# EAGLE design ArduBerry 5_0 (EAGLE 6.4)
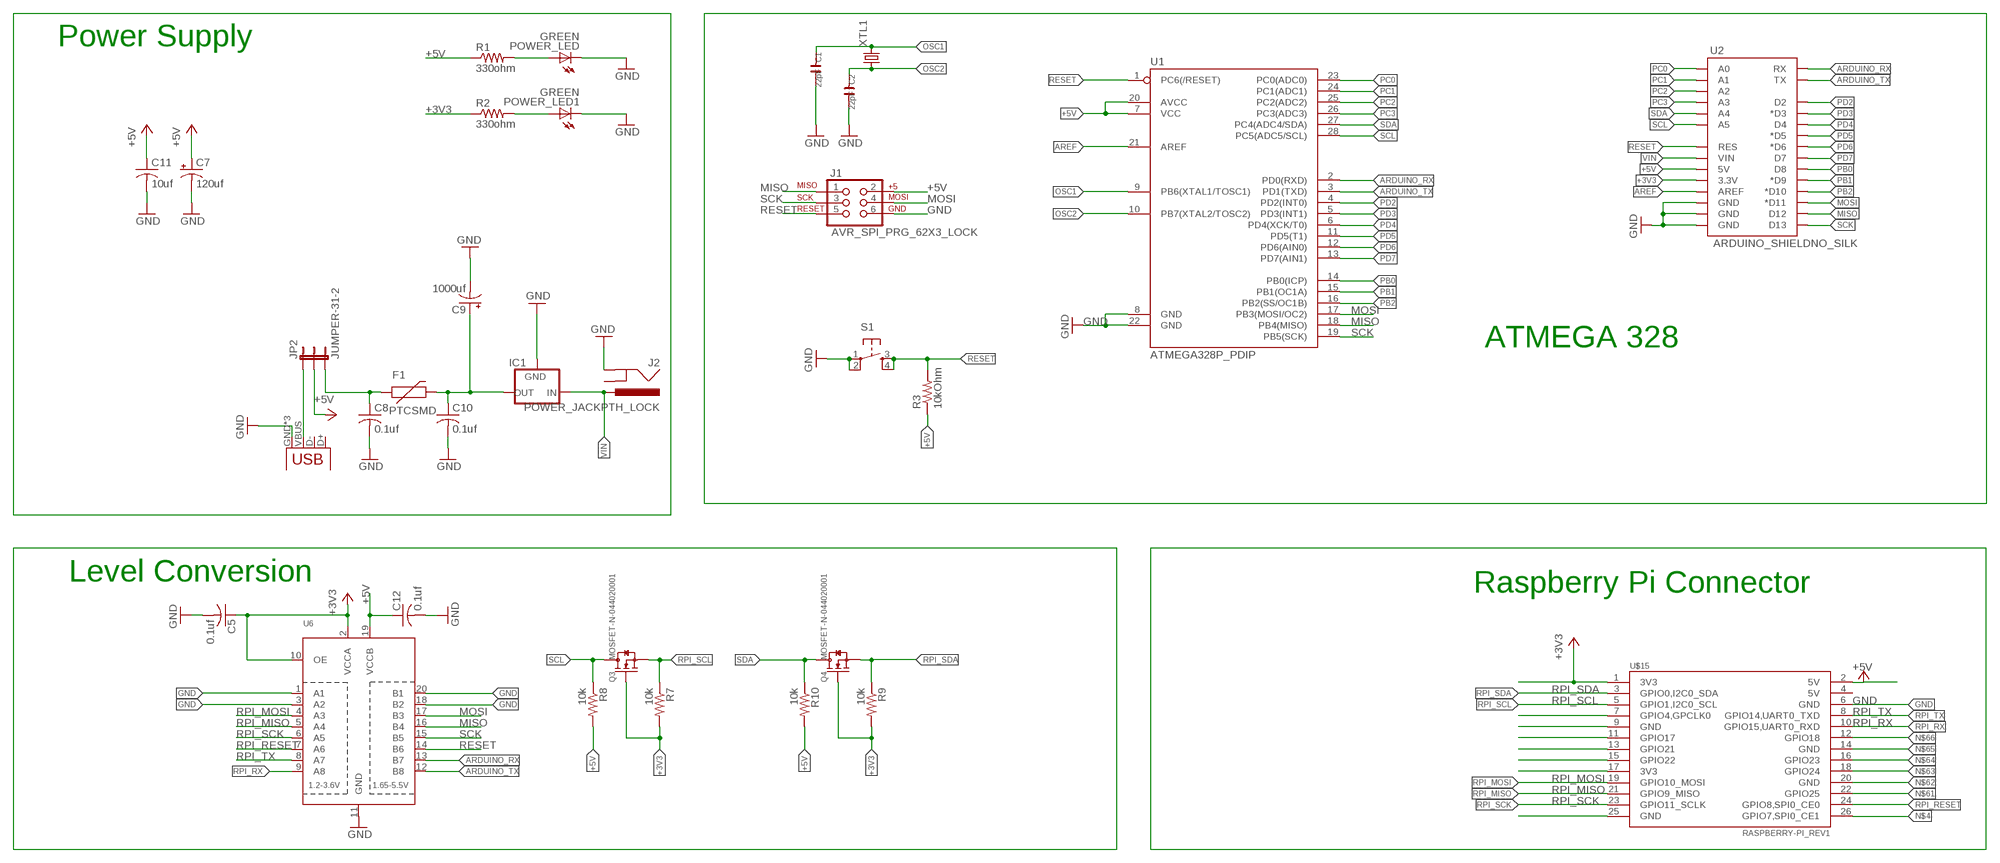
[diagram p0: schematic, sheet 1]

## Parts
C1  22pF  C-0805  [C0805]
C2  22pF  C-0805  [C0805]
C5  0.1uf  C-USC0603  [C0603]
C7  120uf  CPOL-USE2.5-6  [E2,5-6]
C8  0.1uf  C-USC0603  [C0603]
C9  1000uf  CPOL-USE3.5-10  [E3,5-10]
C10  0.1uf  C-USC0603  [C0603]
C11  10uf  C-USC0805  [C0805]
C12  0.1uf  C-USC0603  [C0603]
F1  PTCSMD  [PTC-1206]
IC1  V_REG_78XXSIDE  [78XXL]
J1  AVR_SPI_PRG_62X3_LOCK  [2X3_LOCK]
J2  POWER_JACKPTH_LOCK  [POWER_JACK_PTH_LOCK]
JP1  USB-MICROB  [USB-MICROB]
JP2  JUMPER-31-2  [SJ_3_PASTE1&2]
POWER_LED  GREEN  LED-GREEN0603  [LED-0603]
POWER_LED1  GREEN  LED-GREEN0603  [LED-0603]
Q3  MOSFET-N-044020001  [SOT23]
Q4  MOSFET-N-044020001  [SOT23]
R1  330ohm  RESISTOR0603  [0603-RES]
R2  330ohm  RESISTOR0603  [0603-RES]
R3  10kOhm  RESISTOR0603  [0603-RES]
R7  10k  RESISTOR0603  [0603-RES]
R8  10k  RESISTOR0603  [0603-RES]
R9  10k  RESISTOR0603  [0603-RES]
R10  10k  RESISTOR0603  [0603-RES]
S1  TAC_SWITCHPTH  [TACTILE-PTH]
U1  ATMEGA328P_PDIP  [DIL28-3]
U2  ARDUINO_SHIELDNO_SILK  [DUEMILANOVE_VIAS]
U6  TXB0108PWR  [TSSOP20]
U$15  RASPBERRY-PI_REV1  [RASPBERRY-PI_REV1]
XTL1  CRYSTALHC49S  [HC49/S]

## Nets
5V_IN_USB: JP1.VBUS JP2.1
+3V3 [POWER]: C5.1 Q3.1(G) Q4.1(G) R2.1 R7.2 R9.2 U2.3.3V U6.2(VCCA) U6.10(OE) U$15.1(3V3)
+5V [POWER]: C7.+ C11.1 C12.1 J1.2 JP2.2 R1.1 R3.1 R8.2 R10.2 U1.7(VCC) U1.20(AVCC) U2.5V U6.19(VCCB) U$15.2(5V)
ARDUINO_RX: U1.2(PD0(RXD)) U2.RX U6.13(B7)
ARDUINO_TX: U1.3(PD1(TXD)) U2.TX U6.12(B8)
AREF [DATA]: U1.21(AREF) U2.AREF
GND: C1.2 C2.2 C5.2 C7.- C8.2 C9.- C10.2 C11.2 C12.2 IC1.GND J1.6 J2.GND JP1.GND JP1.MT1(GND) JP1.MT2(GND) POWER_LED1.C POWER_LED.C S1.1 S1.2 U1.8(GND) U1.22(GND) U2.GND@0(GND) U2.GND@1(GND) U2.GND@2(GND) U6.1(A1) U6.3(A2) U6.11(GND) U6.18(B2) U6.20(B1) U$15.6(GND)
MISO: J1.1 U1.18(PB4(MISO)) U2.D12 U6.16(B4)
MOSI: J1.4 U1.17(PB3(MOSI/OC2)) U2.D11(*D11) U6.17(B3)
N$1: POWER_LED1.A R2.2
N$4: U$15.26(GPIO7,SPI0_CE1)
N$11: POWER_LED.A R1.2
N$48: U$15.7(GPIO4,GPCLK0)
N$49: U$15.9(GND)
N$50: U$15.11(GPIO17)
N$51: U$15.13(GPIO21)
N$52: U$15.15(GPIO22)
N$53: U$15.17(3V3)
N$54: U$15.25(GND)
N$61: U$15.22(GPIO25)
N$62: U$15.20(GND)
N$63: U$15.18(GPIO24)
N$64: U$15.16(GPIO23)
N$65: U$15.14(GND)
N$66: U$15.12(GPIO18)
OSC1: C1.1 U1.9(PB6(XTAL1/TOSC1)) XTL1.2
OSC2: C2.1 U1.10(PB7(XTAL2/TOSC2)) XTL1.1
PB0: U1.14(PB0(ICP)) U2.D8
PB1: U1.15(PB1(OC1A)) U2.D9(*D9)
PB2: U1.16(PB2(SS/OC1B)) U2.D10(*D10)
PC0: U1.23(PC0(ADC0)) U2.A0
PC1: U1.24(PC1(ADC1)) U2.A1
PC2: U1.25(PC2(ADC2)) U2.A2
PC3: U1.26(PC3(ADC3)) U2.A3
PD2: U1.4(PD2(INT0)) U2.D2
PD3: U1.5(PD3(INT1)) U2.D3(*D3)
PD4: U1.6(PD4(XCK/T0)) U2.D4
PD5: U1.11(PD5(T1)) U2.D5(*D5)
PD6: U1.12(PD6(AIN0)) U2.D6(*D6)
PD7: U1.13(PD7(AIN1)) U2.D7
REG_OUT [POWER]: C8.1 F1.1 JP2.3
RESET: J1.5 R3.2 S1.3 S1.4 U1.1(PC6(/RESET)) U2.RES U6.14(B6)
RPI_MISO: U6.5(A4) U$15.21(GPIO9_MISO)
RPI_MOSI: U6.4(A3) U$15.19(GPIO10_MOSI)
RPI_RESET: U6.7(A6) U$15.24(GPIO8,SPI0_CE0)
RPI_RX: U6.9(A8) U$15.10(GPIO15,UART0_RXD)
RPI_SCK: U6.6(A5) U$15.23(GPIO11_SCLK)
RPI_SCL: Q3.2(S) R7.1 U$15.5(GPIO1,I2C0_SCL)
RPI_SDA: Q4.2(S) R9.1 U$15.3(GPIO0,I2C0_SDA)
RPI_TX: U6.8(A7) U$15.8(GPIO14,UART0_TXD)
SCK: J1.3 U1.19(PB5(SCK)) U2.D13 U6.15(B5)
SCL: Q3.3(D) R8.1 U1.28(PC5(ADC5/SCL)) U2.A5
SDA: Q4.3(D) R10.1 U1.27(PC4(ADC4/SDA)) U2.A4
VIN: IC1.IN J2.PWR U2.VIN
VIN_5V: C9.+ C10.1 F1.2 IC1.OUT
Unconnected: J2.GNDBREAK JP1.D+ JP1.D- U$15.4(5V)

## Notes on the sheet
- Power Supply
- ATMEGA 328
- Level Conversion
- Raspberry Pi Connector

## Library data of the parts
C1 C2 = OPL:C*
C5 C8 C10 C12 = resistor:C-US: CAPACITOR, American symbol
C7 C9 = rcl:CPOL-US: POLARIZED CAPACITOR, American symbol
C11 = rcl:C-US: CAPACITOR, American symbol
F1 = zz SparkFun:PTC: Resettable Fuse PTC Resettable Fuse. Spark Fun Electronics SKU : COM-08357
IC1 = SparkFun-PowerIC:V_REG_78XX: Voltage Regulator Standard 7805 5V regulator. IGO (Input Ground Output). Spark Fun Electronics SKU : COM-00107
J1 = SparkFun-Connectors:AVR_SPI_PRG_6: AVR ISP 6 Pin This is the reduced ISP connector for AVR programming. Common on Arduino. This footprint will take up less PCB space and can be used with a 10-pin to 6-pin adapter such as SKU: BOB-08508
J2 = SparkFun-Connectors:POWER_JACK: Power Jack This is the standard 5.5mm barrel jack for power. The PTH is the most common, proven, reliable, footprint. The Slot footprint only works if the mill layer is transmitted to the PCB fab house so be warned. Spark Fun Electronics SKU : PRT-00119 SMT: CONN-08106 Mating wall wart : TOL-00298 (and others)
JP1 = SparkFun-Connectors:USB: USB Connectors USB-B-PTH is fully proven SKU : PRT-00139/CONN-08278 USB-miniB is fully proven SKU : PRT-00587 USB-A-PCB is untested. USB-A-H is throughly reviewed, but untested. Spark Fun Electronics SKU : PRT-00437 USB-B-SMT is throughly reviewed, but untested. Needs silkscreen touching up. USB-A-S has not been used/tested USB-MB-H has not been used/tested USB-MICROB has been used. CONN-09505; PROD_ID: CONN-09505
JP2 = SparkFun-Passives:JUMPER-3
POWER_LED POWER_LED1 = SparkFun-LED:LED-GREEN: Various green LEDs 0603- DIO-00821 LARGE- DIO-00862 LILYPAD- DIO-09910; PROD_ID: DIO-00821
Q3 Q4 = OPL:MOSFET-N: CJ2302：SMD MOSFET N-CH 20V-2.1A
R1-R3 R7-R10 = SparkFun-Resistors:RESISTOR: Resistor Basic schematic elements and footprints for 0603, 1206, and PTH resistors.
S1 = SparkFun-Electromechanical:TAC_SWITCH: Momentary Switch Button commonly used for reset or general input. Spark Fun Electronics SKU : COM-00097 SMT- SWCH-08247
U1 = SparkFun-DigitalIC:ATMEGA328P_PDIP: uC used in the Arduino 32kb flash, 1k EEPROM, 2k SRAM This is the through-hole version of this chip.
U2 = SparkFun-Boards:ARDUINO_SHIELD: Arduino shield footprint
U6 = adafruit:TXB0108PWR: 8-Bit Bi-Directional Level Shifter 1.2V-3.6V (VCCA) to 1.65V-5.5V (VCCB) bi-directional level shifter with auto direction sensing. Max data rate - VCCA 1.8V: 20Mbps (50ns), VCCA 3.3V: 100Mbps (10ns) Digikey: 296-21527-1-ND
U$15 = RaspberryPi:RASPBERRY-PI_REV1: Raspberry Pi Board <http://www.raspberrypi.org/> Jacques Lagnel V1.0 (beta) 2012 Mateusz Bawaj V1.1 (beta) 2012 Board dimension: Forum 3D model <http://www.raspberrypi.org/forum/general-discussion/mechanical-profile-3d-models?value=3d%20model&type=1&include=1&search=1&ret=all> The GPIO Connector (P1): http://elinux.org/RPi_Low-level_peripherals
XTL1 = crystal:CRYSTAL: CRYSTAL; OC_FARNELL: 1667008; OC_NEWARK: unknown

## Net classes
1 DATA: width 0.203 mm, drill 0.305 mm, clearance 0.051 mm
2 POWER: width 0.152 mm, drill 0.356 mm, clearance 0.051 mm

## Board
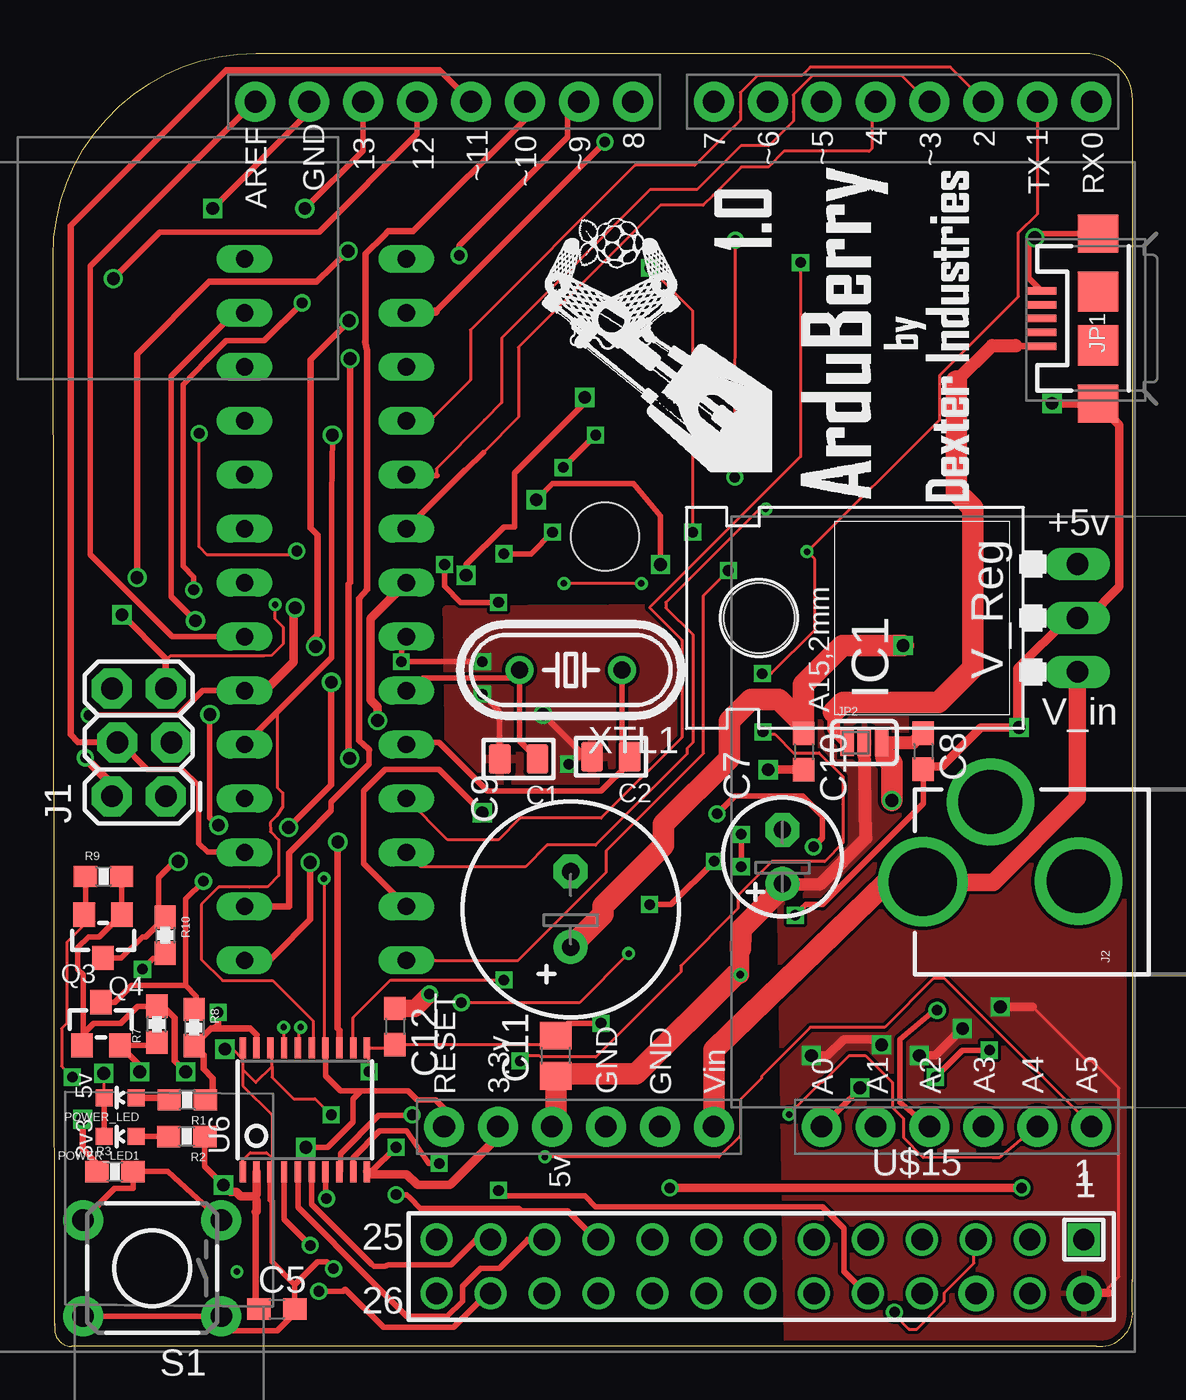
[diagram p1: board, top side]
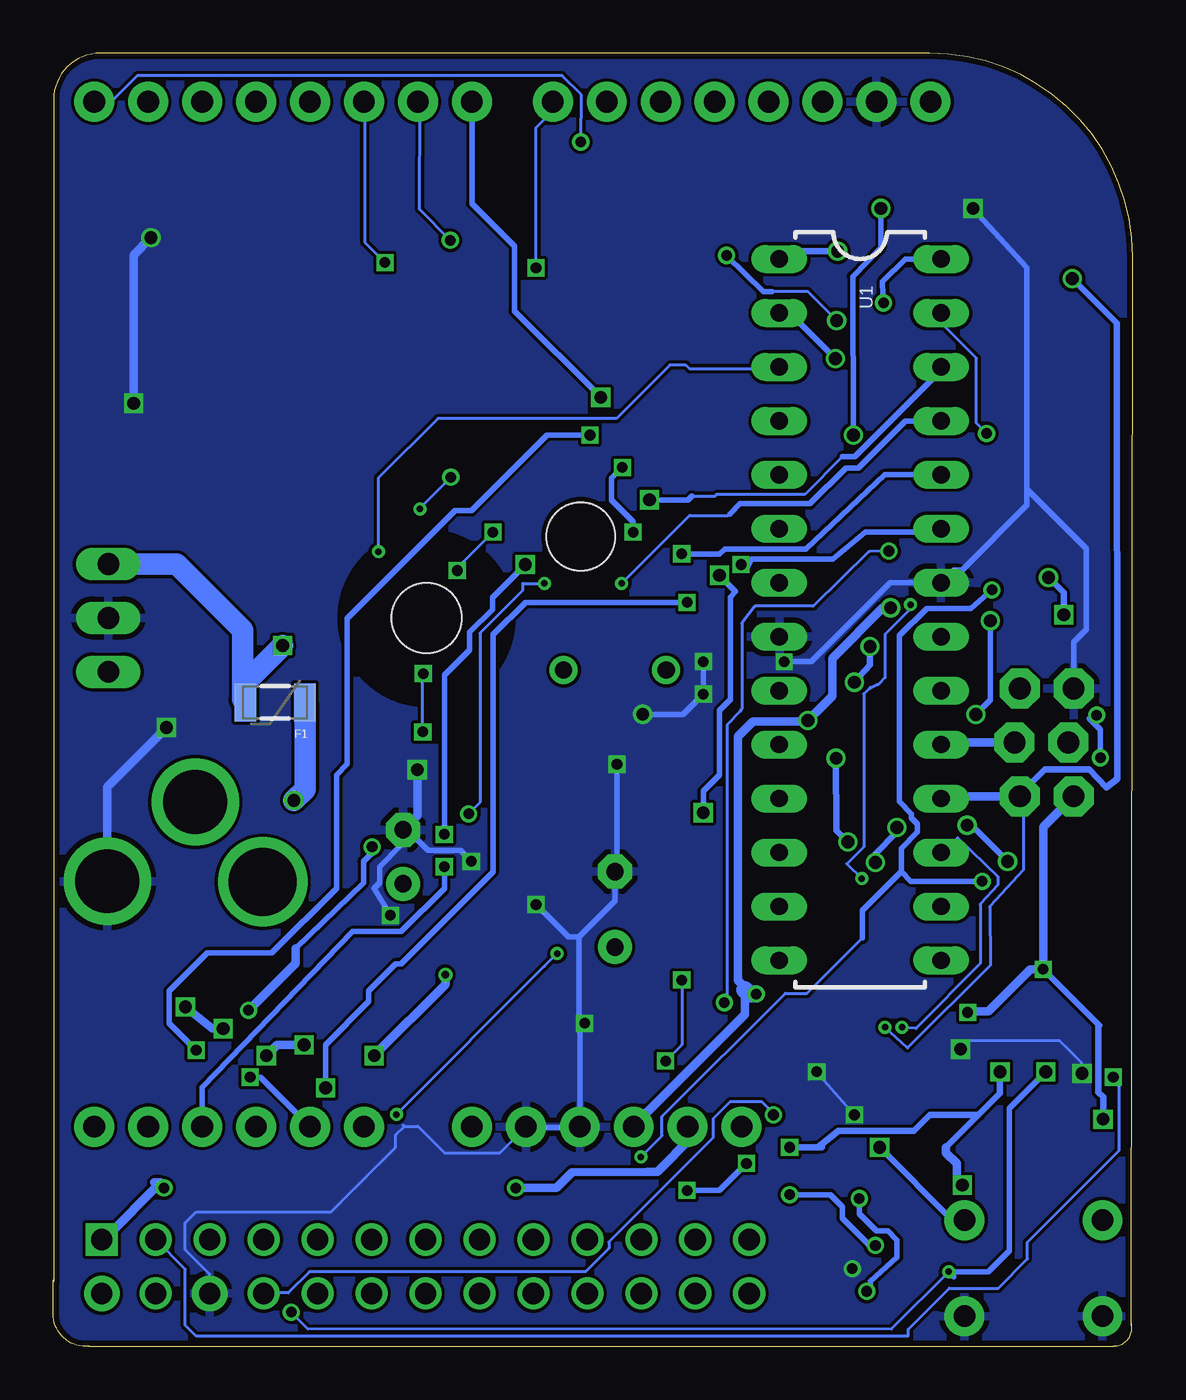
[diagram p2: board, bottom side, seen from below]

Size 50.82 x 60.89 mm. Coordinates in mm from the lower left corner, seen from the top.
Outline: 0.07,0.97 0,51.31 arc-90 9.56,60.89 48.59,60.89 arc-90 50.8,58.68 50.8,3.05
Outline: 49.14,0 0.87,0
Outline: 49.11,0 49.42,0 arc90 50.82,1.68 50.82,3.13
Outline: 0.07,1.07 0.07,0.81 arc90 0.88,0
Copper layers (1*16): Top 0.035mm / dielectric 1.5mm / Bottom 0.035mm
Design rules "Fusion_eagle_rule_v1.1": minimum track width 6mil, minimum drill 12mil, track to track 6mil, track to pad 6mil, pad to pad 6mil, via to via 6mil, smd to smd 0mil, copper to edge 10mil, drill to drill 10mil, minimum pad ring 10mil, minimum via ring 6mil, stop-mask expansion 2mil, vias tented up to drill 100mil, thermal gap 10mil
Holes 3.2 mm at -29.52,11.63 25.98,38.13

### Footprints (pad centres in the part's own frame; a part is rotated, then mirrored left to right if it is on the bottom)
C0805 = smd 1.016 x 1.397: 1 -0.889,0; 2 0.889,0
C0603 = smd 1.1 x 1: 1 -0.85,0; 2 0.85,0
E2,5-6 = drill 0.813 pad 1.6: + -1.27,0 | drill 0.813 pad 1.6 octagon: - 1.27,0
E3,5-10 = drill 0.813 pad 1.6: + -1.778,0 | drill 0.813 pad 1.6 octagon: - 1.778,0
C0805' = smd 1.3 x 1.5: 1 -0.95,0; 2 0.95,0
PTC-1206 = smd 1 x 1.8: 1 -1.4,0; 2 1.4,0
78XXL = drill 1.016 long: GND 0,-3.81; IN -2.54,-3.81; OUT 2.54,-3.81 | hole 3.302: 0,11.176
2X3_LOCK = drill 1.016 pad 1.88 octagon: 1 0,0; 2 0,2.54; 3 2.54,-0.254; 4 2.54,2.286; 5 5.08,0; 6 5.08,2.54
POWER_JACK_PTH_LOCK = drill 2.997 pad 4.115: GND 0.025,6.557; GNDBREAK 3.762,10.7 | drill 3.2 pad 4.115: PWR 0,13.878
USB-MICROB = smd 0.35 x 1.4: D+ 0,2.65; D- -0.65,2.65; GND 1.3,2.65; ID 0.65,2.65; VBUS -1.3,2.65 | smd 1.8 x 1.9: MT1 -4,0; MT2 4,0 | smd 1.9 x 1.9: P$1 -1.27,0; P$2 1.27,0
SJ_3_PASTE1&2 = smd 0.635 x 1.27: 1 -0.813,0; 2 0,0; 3 0.813,0
LED-0603 = smd 0.8 x 0.8: A 0,-0.75; C 0,0.75
SOT23 = smd 1.016 x 1.143: 1 -0.889,-1.016; 2 0.889,-1.016; 3 0,1.016
0603-RES = smd 1.1 x 1: 1 -0.85,0; 2 0.85,0
TACTILE-PTH = drill 1.016 pad 1.88: 1 -3.251,2.261; 2 3.251,2.261; 3 -3.251,-2.261; 4 3.251,-2.261
DIL28-3 = drill 0.813 long: 1 -16.51,-3.81; 2 -13.97,-3.81; 3 -11.43,-3.81; 4 -8.89,-3.81; 5 -6.35,-3.81; 6 -3.81,-3.81; 7 -1.27,-3.81; 8 1.27,-3.81; 9 3.81,-3.81; 10 6.35,-3.81; 11 8.89,-3.81; 12 11.43,-3.81; 13 13.97,-3.81; 14 16.51,-3.81; 15 16.51,3.81; 16 13.97,3.81; 17 11.43,3.81; 18 8.89,3.81; 19 6.35,3.81; 20 3.81,3.81; 21 1.27,3.81; 22 -1.27,3.81; 23 -3.81,3.81; 24 -6.35,3.81; 25 -8.89,3.81; 26 -11.43,3.81; 27 -13.97,3.81; 28 -16.51,3.81
DUEMILANOVE_VIAS = drill 1.016 pad 1.88: 3.3V 50.8,13.97; 5V 50.8,16.51; A0 50.8,29.21; A1 50.8,31.75; A2 50.8,34.29; A3 50.8,36.83; A4 50.8,39.37; A5 50.8,41.91; AREF 2.54,2.54; D2 2.54,36.83; D3 2.54,34.29; D4 2.54,31.75; D5 2.54,29.21; D6 2.54,26.67; D7 2.54,24.13; D8 2.54,20.32; D9 2.54,17.78; D10 2.54,15.24; D11 2.54,12.7; D12 2.54,10.16; D13 2.54,7.62; GND@0 50.8,19.05; GND@1 50.8,21.59; GND@2 2.54,5.08; RES 50.8,11.43; RX 2.54,41.91; TX 2.54,39.37; VIN 50.8,24.13
TSSOP20 = smd 0.305 x 0.991: 1 -2.925,-2.918; 2 -2.275,-2.918; 3 -1.625,-2.918; 4 -0.975,-2.918; 5 -0.325,-2.918; 6 0.325,-2.918; 7 0.975,-2.918; 8 1.625,-2.918; 9 2.275,-2.918; 10 2.925,-2.918; 11 2.925,2.918; 12 2.275,2.918; 13 1.625,2.918; 14 0.975,2.918; 15 0.325,2.918; 16 -0.325,2.918; 17 -0.975,2.918; 18 -1.625,2.918; 19 -2.275,2.918; 20 -2.925,2.918
RASPBERRY-PI_REV1 = drill 1 square: 1 -41.91,21.59 | drill 1 pad 1.676: 2 -41.91,24.13; 6 -36.83,24.13 | drill 1: 3 -39.37,21.59; 4 -39.37,24.13; 5 -36.83,21.59; 7 -34.29,21.59; 8 -34.29,24.13; 9 -31.75,21.59; 10 -31.75,24.13; 11 -29.21,21.59; 12 -29.21,24.13; 13 -26.67,21.59; 14 -26.67,24.13; 15 -24.13,21.59; 16 -24.13,24.13; 17 -21.59,21.59; 18 -21.59,24.13; 19 -19.05,21.59; 20 -19.05,24.13; 21 -16.51,21.59; 22 -16.51,24.13; 23 -13.97,21.59; 24 -13.97,24.13; 25 -11.43,21.59; 26 -11.43,24.13
HC49/S = drill 0.813: 1 -2.413,0; 2 2.413,0

### Placement (x,y rotation side)
C1  21.92,27.66 180 top
C2  26.26,27.76 180 top
C5  10.53,1.75 0 top
C7  34.34,23.05 90 top
C8  40.96,28.02 270 top
C9  24.37,20.58 90 top
C10  35.34,28 270 top
C11  10uf  [C0805']  23.67,13.69 90 top
C12  16.09,15.06 270 top
F1  40.36,30.32 180 bottom
IC1  44.42,34.29 90 top
J1  5.31,25.89 90 top
J2  54.83,21.87 90 top
JP1  49.19,48.39 90 top
JP2  38.19,28.42 0 top
POWER_LED  3.16,11.71 90 top
POWER_LED1  3.17,9.88 90 top
Q3  2.25,15.19 0 top
Q4  2.35,19.31 180 top
R1  6.31,11.61 180 top
R2  6.29,9.88 180 top
R3  2.91,8.23 0 top
R7  4.89,15.17 90 top
R8  6.65,15.01 270 top
R9  2.38,22.12 0 top
R10  5.27,19.36 270 top
S1  4.66,3.68 180 top
U1  12.82,34.68 270 bottom
U2  6.98,61.14 270 top
U6  11.85,11.13 0 top
U$15  6.62,26.62 180 top
XTL1  24.37,31.84 180 top

### Tracks (layer width: path | path; a pad name or v marks a point on that pad's centre or on a via)
5V_IN_USB
  Top 0.305: 45.33,47.09 JP1.VBUS
  Top 0.61: 42.54,45.44 44.21,47.12 45.3,47.12 45.33,47.09 | 36.74,29.87 36.74,29.06 JP2.1
  Top 1.016: 42.54,45.44 42.54,40.24 43.3,39.47 43.3,31.93 41.67,30.3 37.18,30.3 36.74,29.87
+3V3  (via drill 0.5, 0.6)
  Top 0.254: R9.2 3.23,20.34 Q4.1 3.22,20.32 2.18,19.28 1.67,19.28 1.16,18.77 1.16,17.76 1.41,17.5 1.41,14.71 | 1.41,14.71 1.41,14.23 Q3.1 | R7.2 3.99,16.02 3.19,15.22 1.92,15.22 1.41,14.71 | R2.1 7.14,8.47 v8.02,7.6
  Top 0.305: R7.2 5.19,16.02 5.73,15.47 5.73,13.44 v6.24,12.93 | 9.54,6.33 9.54,1.9 C5.1 | 9.58,6.87 U6.2 9.58,8.14 9.54,8.1 | U6.10 14.98,8.21 v16.15,9.37
  Top 0.406: v45.6,7.46 v29.04,7.46 | U2.3.3V 20.95,9.86 18.69,7.6 17.16,7.6 16.65,8.1 14.88,8.1 U6.10 | 9.58,6.87 9.58,6.36 9.54,6.33 | U6.2 9.58,7.15 9.49,7.06 8.83,7.06 8.63,7.27 8.35,7.27 v8.02,7.6
  Bottom 0.305: v6.24,12.93 6.24,11.91 7.26,10.9 | 7.26,10.9 8.78,9.37 | 14.62,9.37 14.82,9.37 | 14.82,9.37 13.86,10.14 10.3,10.14 9.54,10.9 7.26,10.9 | v16.15,9.37 15.07,9.37 14.82,9.37
  Bottom 0.406: v29.04,7.46 28.72,7.47 27.12,7.47 26.38,8.21 22.85,8.22 22.38,8.22 20.72,9.88 20.72,10.11 U2.3.3V | v45.6,7.46 46.05,7.72 45.75,7.72 48.35,5.12 U$15.1 | 8.78,9.37 8.78,9.12 8.27,8.61 8.27,7.85 v8.02,7.6
+5V  (via drill 0.36, 0.5, 0.6)
  Top 0.152: U6.19 9.58,13.98 9.54,13.95 | 49.67,2.52 49.67,2.77 50.18,3.28 50.18,12.17 48.91,13.44 48.66,13.44 46.12,15.98
  Top 0.254: v1.69,29.72 5.88,29.72 7.04,30.87 U1.20 | 7.51,11.95 R1.1 | U6.19 9.58,14.67 | 7.45,14.96 R8.2 6.71,14.16 | R10.2 5.52,18.26 4.72,18.26 v4.21,17.76
  Top 0.305: 9.58,14.67 9.29,14.96 7.56,14.96 | 7.56,14.96 7.45,14.96 | 7.51,11.95 7.51,12.63 7.08,13.06 7.08,13.73 R8.2 | R3.1 2.06,8.62 1.39,9.3 v1.39,10.7 | v7.76,15.72 7.76,15.17 7.56,14.96
  Top 0.406: U2.5V 23.68,10.34 | U1.20 9.98,30.87 11.32,32.21 11.32,34.7 v11.4,34.77 | v15.28,29.47 15.28,30.1 14.95,30.43 14.95,34.27 U1.7 | 34.25,21.52 C7.+ | 23.85,12.82 C11.1 | 32.15,17.52 v32.35,17.5 | v35.7,13.69 36.47,13.69 37.23,14.45 38.75,14.45 v39.01,14.2 | v40.78,13.69 41.55,13.69 v42.82,14.96 | v44.59,15.98 46.12,15.98 | 49.67,2.52 48.56,2.52 U$15.2 | J1.2 2.77,26.46 v1.52,27.71
  Top 0.61: C7.+ 36.09,21.75 38.27,23.93 JP2.2
  Top 0.813: 32.35,18.72 v32.35,17.5 | C12.1 17.05,15.91 v17.72,16.59
  Top 1.016: 23.68,10.34 C11.1 | 32.35,18.72 32.38,19.41 32.4,19.65 34.25,21.52 | 23.85,12.82 27.45,12.82 32.15,17.52
  Bottom 0.254: v1.69,29.72 2.05,29.57 1.52,29.03 v1.52,27.71
  Bottom 0.305: v1.39,10.7 1.39,11.74 1.62,11.97 1.62,15.06 1.57,15.11 v4.21,17.76
  Bottom 0.406: v11.4,34.77 11.75,34.77 14.14,32.39 14.14,30.61 v15.28,29.47 15.45,29.42 17.88,29.42 18.58,28.72 18.58,17.22 18.25,16.89 18.25,16.79 18.25,15.62 23.45,10.42 U2.5V | v32.35,17.5 32.35,17.04 v35.7,13.69 | v39.01,14.2 40.28,14.2 v40.78,13.69 | v42.82,14.96 43.32,14.96 v44.59,15.98 | v7.76,15.72 7.71,15.78 6.8,15.78 4.82,17.76 v4.21,17.76 4.21,24.46 J1.2
  Bottom 0.813: v17.72,16.59 18.05,16.59 18.25,16.79
  pour Top: 33.77,49.51 34.53,0.23 50.64,0.13 50.74,49.61
ARDUINO_RX  (via drill 0.5, 0.6)
  Top 0.254: 18,48.72 v25.98,56.7
  Top 0.305: v13.99,46.51 13.99,35.97 13.91,35.89 13.91,30.23 13.91,27.66 v13.96,27.69 | v13.4,23.75 13.4,14.96 13.48,14.89 U6.13
  Top 0.406: 18,48.72 16.7,48.72 U1.2
  Bottom 0.152: v25.98,56.7 25.95,58.92 26.85,59.82 46.85,59.82 48.05,58.62 48.85,58.62 U2.RX
  Bottom 0.305: U1.2 16.13,48.65 v13.99,46.51 | v13.96,27.69 13.94,24.28 v13.4,23.75
ARDUINO_TX  (via drill 0.3, 0.5)
  Top 0.152: U2.TX 46.35,58.42 46.35,53.32 45.45,52.42 45.45,49.42 41.75,45.72 41.75,43.62 35.53,37.42 v35.5,37.42 35.86,37.07 35.86,33.73 33.8,31.68 v33.39,31.68 | U6.12 14.13,15.48 15.89,17.25 v21.23,17.25 | v21.99,13.44 22.24,13.69 22.88,13.69 22.95,13.62 25.55,13.62 29.55,17.62 29.55,17.92 32.25,20.62 32.25,21.22 33.85,22.82 36.33,22.82 37.18,23.69 37.18,25.53 37.18,26.82 36.06,27.94 34.87,27.94 34,28.81 33.54,28.81 v33.42,28.93
  Top 0.254: U2.TX 46.35,58.52
  Top 0.305: U1.3 17.63,46.11
  Bottom 0.152: U1.3 16.65,46.02 20.85,46.02 21.04,46.2 21.78,46.2 24.3,43.69 32.71,43.69 35.5,40.89 v35.5,37.42 | v21.23,17.25 21.23,14.2 v21.99,13.44 | v33.42,28.93 33.42,31.73 v33.39,31.68
AREF
  Top 0.254: U2.AREF 9.49,58.6 1.74,50.85 1.74,37.29 5.6,33.43 9,33.43 U1.21
GND  (via drill 0.48, 0.5, 0.6)
  Top 0.152: 34.25,24.22 C7.- | 46.12,52.25 46.15,52.22 v46.22,52.2 | 8.93,13.04 8.93,12.27 10.3,10.9 10.3,8.87 | 10.3,8.87 10.3,8.28 U6.3 | U6.20 8.93,13.51 | 8.93,13.51 8.93,13.04 | 8.93,13.04 9.54,12.42 10.3,13.18 | 10.3,13.18 10.3,13.97 U6.18 | 2.41,11.68 POWER_LED.C 2.41,12.82 v2.38,12.85 | U6.1 8.93,8.76 9.29,9.12 10.05,9.12 10.3,8.87 | 10.3,13.18 10.3,12.68 11.32,11.66 12.34,11.66 v13.1,10.9 | v14.88,12.93 14.88,13.95 U6.11 15.93,14.04 C12.2 23.24,14.21 C11.2 | v8.09,14 8.45,14 8.93,13.51
  Top 0.254: JP1.MT2 46.26,52.39 46.12,52.25 45.94,52.07 45.94,50.29 JP1.GND | 11.38,2.91 C5.2 11.38,1.56 10.56,0.74 8.37,0.74 S1.1 S1.2 | 11.38,2.91 12.46,3.99 12.87,3.99 v13.2,3.66 | U2.GND@2 12.06,58.12 v7.51,53.57 | v23.07,29.76 25.16,27.66 25.29,27.66 25.37,27.75 C2.2 24.63,27.76 v24.27,27.41 | U1.8 16.4,33.18 v16.4,32.23 v20.21,32.23 | U6.3 10.23,6.91 10.3,6.83 10.3,3.99 11.38,2.91 | C1.2 21.03,29.64 20.97,29.69 20.97,29.95 v20.21,30.71 | C8.2 40.96,25.56 36.21,20.8 35.45,20.8 v34.94,20.3 | v25.8,15.22 24.25,15.22 23.24,14.21 23.27,14.21 23.77,14.71 | v28.08,20.8 29.1,20.8 v31.13,22.84 | POWER_LED1.C 2.42,11.7 POWER_LED.C
  Top 0.406: C10.2 v33.67,27.15 | C8.2 41.1,27.31 41.85,27.31 43.68,29.14 v45.48,29.14 45.41,29.21 45.41,31.9 47.79,34.29 IC1.GND 48.73,34.29 50.21,35.77 50.21,43.37 JP1.MT1 47.04,44.39 v47.03,44.4
  Bottom 0.152: 34.35,10.42 34.28,10.36 | 26.15,10.32 U2.GND@0 | U$15.6 43.45,3.41 44.59,4.55 44.59,5.82 44.09,6.33 37.74,6.33 34.69,9.37 34.69,9.95 34.28,10.36 | 34.28,10.36 33.64,10.36 32.4,9.12 29.79,9.12 28.93,9.97 U2.GND@1 | v13.1,10.9 v14.88,12.93 | v2.38,12.85 2.38,13.34 3.42,14.38 7.71,14.38 v8.09,14
  Bottom 0.254: v13.2,3.66 13.2,3.61 13.22,3.58 | v7.51,53.57 4.97,50.78 4.97,40.36 | 4.97,40.36 4.97,39.6 8.02,36.55 8.42,36.55 U1.22 11.41,35.95 15.13,32.23 v16.4,32.23 | J1.6 2.77,33.16 2.18,33.76 2.18,37.57 4.97,40.36 | v24.27,27.41 24.27,22.45 C9.- 24.37,20.96 26.05,19.28 | v20.21,32.23 v20.21,30.71 21.16,29.76 v23.07,29.76 | v34.94,20.3 35.7,21.57 35.45,21.82 35.45,22.58 34.43,23.6 34.43,24.23 C7.- 33.87,23.85 33.67,23.85 33.16,23.34 31.64,23.34 v31.13,22.84 | 26.05,19.28 26.05,15.47 v25.8,15.22 26.03,14.99 U2.GND@0 | 26.05,19.28 26.56,19.28 v28.08,20.8 | 26.15,10.32 28.58,10.32 28.93,9.97
  Bottom 0.406: v33.67,27.15 33.67,24.99 C7.- | J2.GND 48.27,26.35 v45.48,29.14 | v47.03,44.4 47.03,51.39 v46.22,52.2
  pour Bottom: 0.02,64.75 50.92,64.75 50.92,-0.28 0.09,-0.28 0.09,64.14
  pour Top: 18.53,34.7 30,34.77 30.1,26.23 18.66,26.13 18.56,34.11
MISO  (via drill 0.3, 0.6)
  Top 0.152: v11.65,15.02 11.55,14.92 11.55,14.12 U6.16
  Top 0.254: U2.D12 17.14,57.1 12.51,52.45 5.02,52.45 3.43,50.89 3.19,50.65
  Top 0.305: v2.84,50.27 2.84,50.29 3.43,50.89
  Bottom 0.152: v11.65,15.02 10.6,14.05 6.7,17.93 6.72,20.7 5.15,22.42 5.15,25.82 J1.1
  Bottom 0.305: J1.1 5.31,25.98 4.13,27.15 2.05,27.15 1.24,26.32 0.73,26.72 0.75,48.19 v2.84,50.27
  Bottom 0.406: J1.1 9.01,25.89 U1.18
MOSI  (via drill 0.3)
  Top 0.152: v10.85,15.02 10.85,14.12 U6.17
  Top 0.254: J1.4 3.18,28.43 4.44,27.15 6.09,27.15 6.85,26.42 6.85,23.67 7.28,23.27 8.59,23.27 U1.17
  Top 0.305: 3.18,28.43 1.15,28.46 0.83,28.81 0.83,52.76 8.14,60.07 18.2,60.07 U2.D11
  Bottom 0.152: v10.85,15.02 10.2,14.97 7.17,18.03 7.17,20.83 6.35,21.72 6.35,22.12 8.23,23.95 8.93,23.25 U1.17
N$1
  Top 0.254: POWER_LED1.A R2.2
N$11
  Top 0.305: POWER_LED.A 5.36,11.71 R1.2
OSC1
  Top 0.254: U1.9 16.82,30.87 17.42,31.47 21.59,31.47 XTL1.2 21.96,28.5 C1.1
OSC2
  Top 0.254: XTL1.1 26.79,28.13 C2.1 27.15,27.49 25.8,26.14 20.46,26.14 18.18,28.42 16.73,28.42 U1.10
PB0  (via drill 0.5)
  Top 0.152: U1.14 21.9,18.17 26.05,22.33 26.05,23.34 30.62,27.92 30.62,35.36 v31.79,36.53 | v30.12,38.33 30.12,48.74 v28.08,50.78
  Bottom 0.152: v31.79,36.53 31.89,36.55 v30.12,38.33 | v28.08,50.78 28.08,57.38 27.32,58.14 27.32,58.57 U2.D8
PB1  (via drill 0.5, 0.6)
  Top 0.254: v19.12,51.36 19.12,51.82 24.22,56.92 24.22,58.07 U2.D9
  Top 0.305: v13.94,48.29 13.94,48.26 12.13,46.46 12.13,38.56 | 12.13,38.56 12.13,38.53 | 12.13,38.53 12.13,38.56 | 12.13,38.56 12.13,38.53 | 12.13,38.53 12.46,38.2 12.46,33.5 12.13,33.17 v12.36,32.95 | v13.1,31.27 13.1,26.44 v11.09,24.44 | v12.11,22.79 12.11,20.09 10.46,18.44 10.19,18.17 U1.15
  Bottom 0.152: 16.98,49.65 15.28,49.65 13.95,48.32 v13.94,48.29 | 24.75,58.52 U2.D9
  Bottom 0.254: 16.98,49.65 17.38,49.65 v19.12,51.36
  Bottom 0.305: v12.36,32.95 12.36,32.08 v13.1,31.27 | v11.09,24.44 11.09,24.21 12.11,23.19 12.11,23.04 v12.11,22.79
PB2
  Top 0.254: 14.88,28.07 14.88,27.41 13.1,25.63 13.1,25.22 11.88,24
  Top 0.305: U2.D10 22.22,57.76 16.96,52.5 15.76,52.5 15.59,52.3 14.72,51.44 14.72,47.32 14.7,47.3 14.77,46.89 14.77,35.64 14.42,35.21 14.42,28.53 14.85,28.12 14.88,28.07 | 11.88,24 11.12,23.24 11.12,20.71 U1.16
PC0  (via drill 0.5, 0.6)
  Top 0.254: v37.99,12.17 37.51,11.66 U2.A0 | v20.97,35.03 19.19,35.03 18.43,35.79 v18.43,36.81
  Bottom 0.254: v37.99,12.17 37.99,14.2 35.96,16.23 35.96,16.74 34.69,18.01 34.43,18.01 30.12,22.33 30.12,33.5 28.59,35.03 v20.97,35.03 | v18.43,36.81 18.18,36.55 17.92,37.06 14.11,37.06 12.59,38.33 9.18,38.33 U1.23
PC1  (via drill 0.5)
  Top 0.254: v21.23,37.31 22.5,37.31 v23.51,38.33 | v24.02,41.38 v25.54,42.9 | v44.09,13.95 42.82,13.95 v41.55,12.68
  Bottom 0.254: U1.24 11.66,41.03 15.38,37.54 19.19,37.54 19.45,37.31 v21.23,37.31 | v23.51,38.33 23.51,38.84 24.53,39.85 24.53,40.87 v24.02,41.38 | v25.54,42.9 27.58,42.9 31.13,39.35 31.89,39.35 36.97,34.27 36.97,27.41 37.48,26.9 37.48,21.57 40.53,18.52 43.58,18.52 45.36,16.74 45.36,15.22 v44.09,13.95 | v41.55,12.68 41.06,12.68 U2.A1
PC2  (via drill 0.3, 0.5)
  Top 0.152: v27.69,35.92 v24.05,35.92
  Top 0.254: 31.26,25.15 v31.26,25.07 32.1,25.91 35.27,25.91 36.21,24.97 36.21,23.93 v35.81,23.52 | v41.62,15.83 41.49,15.83 39.87,14.45 39.87,11.48 U2.A2
  Bottom 0.152: v24.05,35.92 20.85,39.12 19.05,39.12 18.96,39.19 | v27.69,35.92 28.71,35.92 28.71,35.59 30.73,33.58 30.73,25.61 v31.26,25.07
  Bottom 0.254: U1.25 10.7,43.57 12.92,41.35 13.5,41.35 15.18,39.68 18.48,39.68 18.96,39.19 | 39.41,18.75 36.21,21.82 36.21,22.84 35.81,23.24 v35.81,23.52
  Bottom 0.406: 39.41,18.75 39.41,18.04 v41.62,15.83
PC3  (via drill 0.5, 0.6)
  Top 0.254: v28.59,36.81 28.59,39.09 27.32,40.62 23.51,40.62 v22.75,39.85 | v32.4,22.58 v32.4,24.11
  Bottom 0.152: 13.66,41.89 15.43,40.11 19.6,40.11 19.65,40.02 20.75,40.02
  Bottom 0.254: U1.26 9.01,45.94 13.07,41.89 13.66,41.89 | U2.A3 43.81,12.19 36.72,19.53 34.43,19.53 32.4,21.57 v32.4,22.58 | v22.75,39.85 20.92,39.85 20.75,40.02 | v32.4,24.11 32.4,31.6 31.21,32.79 31.21,33.63 30.14,34.7 30.14,35.26 v28.59,36.81
PD2
  Top 0.152: U1.4 16.75,43.62 17.85,43.62 17.75,43.59 19.65,45.49 19.65,47.86 27.4,55.6 30.22,55.6 32.35,57.74 32.35,58.12 32.35,59.02 33.15,59.82 35.25,59.82 35.65,60.22 42.25,60.22 43.75,58.72 U2.D2
  Top 0.254: U2.D2 43.81,58.5 | 16.65,43.59 U1.4
PD3
  Top 0.152: 18.05,41 18.05,41.12 18.05,41.32 20.31,43.61 21.12,44.43 21.12,47.47 28.11,54.46 30.32,54.46 32.38,56.52 33.7,56.52 34.85,57.67 34.85,58.12 34.85,58.92 35.75,59.82 39.95,59.82 41.15,58.62 U2.D3
  Top 0.254: U2.D3 41.27,58.47 | 18.08,41 18.05,41 16.67,41 U1.5
PD4
  Top 0.152: 20.26,42.09 21.91,43.74 21.91,47.04 28.59,53.72 30.6,53.72 31.08,54.21 32.4,55.53 33.67,55.53 34.41,56.26 38.42,56.26 38.55,56.4 38.55,58.52 U2.D4
  Top 0.254: U2.D4 38.65,58.6 | U1.6 19.39,41.25 19.42,41.25 20.26,42.09
PD5  (via drill 0.5)
  Top 0.152: v35.2,51.03 35.2,41.89 28.08,34.77 29.61,33.25 29.61,28.68 25.8,24.87 21.99,24.87 20.97,23.85 18.58,23.85 U1.11
  Top 0.254: U2.D5 36.19,58.55
  Bottom 0.152: U2.D5 36.15,58.52 36.15,51.99 v35.2,51.03
PD6  (via drill 0.3, 0.5)
  Top 0.152: v32.1,40.92 v32.12,52.07 | v33.55,39.42 33.25,39.42 28.85,35.02 28.85,34.77 30.12,33.5 30.12,28.42 29.86,28.17 29.86,27.92 25.54,23.6 23.26,23.6 22.24,22.58 17.31,22.58 U1.12
  Top 0.305: U2.D6 33.65,58.14
  Bottom 0.152: v33.55,39.42 33.54,39.47 v32.1,40.92 | v32.12,52.07 33.58,53.53 33.55,58.52 U2.D6
PD7  (via drill 0.6)
  Top 0.254: v25.04,44.68 25.04,44.43 21.73,41.12 21.73,38.58 21.23,38.58 19.45,36.81 v19.45,36.3 | U1.13 14.62,22.73 14.62,26.14 15.64,27.15 18.18,27.15 v20.21,25.12
  Bottom 0.254: U2.D7 31.11,53.8 29.1,51.79 29.1,48.74 v25.04,44.68 | v20.21,25.12 20.21,26.14 19.45,26.9 19.45,29.95 18.94,30.46 18.94,35.28 18.69,35.54 v19.45,36.3
REG_OUT  (via drill 0.6)
  Top 0.406: 39.21,27.74 39.21,28.22 JP2.3
  Top 0.61: JP2.3 40.49,28.42 C8.1
  Top 1.016: v39.49,25.71 39.49,27.46 39.21,27.74
  Bottom 1.016: F1.1 38.96,26.23 v39.49,25.71
RESET  (via drill 0.3, 0.6)
  Top 0.152: v12.75,22.02 12.75,14.12 U6.14 | v10.45,34.92 10.45,34.25 10.85,33.85 10.85,33.09 10.3,32.54 9.95,32.52 5.55,32.52 5.45,32.42 5.31,32.38
  Top 0.254: U6.14 12.83,12.74 13.53,12.04 14.49,12.04 | 14.49,12.04 16.7,12.04 17.14,11.61 18,11.61 18.41,11.2 U2.RES | S1.3 5.4,8.23 R3.2 3.78,8.22 3.78,7.44 2.91,7.44 S1.4 | v11.9,9.37 12.92,9.37 14.11,10.57 14.11,11.66 14.49,12.04
  Top 0.305: J1.5 5.31,32.38 v3.24,34.44 | v3.95,36.2 3.95,46.71 7.36,50.12 12.41,50.12 v13.88,51.56
  Bottom 0.152: v12.75,22.02 13.45,22.72 12.65,23.52 12.65,30.72 12.35,31.02 12.33,30.99 11.98,31.16 11.93,31.2 11.65,31.48 11.65,33.52 10.45,34.72 v10.45,34.92
  Bottom 0.254: S1.3 8.47,5.95 v11.9,9.37
  Bottom 0.305: v3.24,34.44 3.24,35.49 v3.95,36.2 | v13.88,51.56 16.26,51.56 U1.1
RPI_MISO
  Top 0.254: U$15.21 22.34,5.03 22.34,5.01 21.02,3.68 20.13,3.68 19.27,2.82 19.27,2.14 18.56,1.42 16.65,1.42 15,3.08 11.53,6.55 U6.5
RPI_MOSI  (via drill 0.5)
  Top 0.254: U$15.19 25.57,5.03 24.6,6 24.22,6.38 22.04,6.38 21.91,6.5 17.29,6.5 16.81,6.99 16.65,7.14 v16.15,7.14 | U6.4 10.88,5.98 v12.11,4.75
  Bottom 0.254: v12.11,4.75 12.41,4.78 13.66,6.02 13.66,6.58 14.22,7.14 v16.15,7.14
RPI_RESET  (via drill 0.5)
  Top 0.254: U$15.24 20.46,2.49 18.86,0.89 15.56,0.89 13.76,2.69 13.66,2.59 v12.51,2.59 | U6.7 12.83,7 v12.87,6.96
  Bottom 0.254: v12.87,6.96 12.87,6.25 12.06,5.44 11.52,5.44 11.09,5.01 11.09,4.19 12.34,3.08 12.34,2.85 12.41,2.77 12.41,2.69 v12.51,2.59
RPI_RX  (via drill 0.5)
  Top 0.254: U$15.10 38.27,2.49 37.23,3.53 37.23,5.56 36.21,6.58 25.54,6.58 25.04,7.09 21.23,7.09 v20.97,7.34 | v18.18,8.61 17.67,8.61 16.65,10.14 15.38,10.14 14.11,8.87 U6.9
  Bottom 0.254: v20.97,7.34 19.45,7.34 v18.18,8.61
RPI_SCK
  Top 0.254: U$15.23 19.93,5.03 18.74,3.84 15.79,3.84 15.61,3.76 15.1,3.76 15,3.86 12.18,6.69 U6.6
RPI_SCL  (via drill 0.3, 0.5, 0.6)
  Top 0.152: 43.35,5.02 43.35,3.92 41.95,2.52 41.95,2.12 41.85,2.01 40.66,0.81 40.3,0.81 39.61,1.5 v39.61,1.61
  Top 0.254: R7.1 4.75,14.18 Q3.2 4.08,13.24 v4.08,12.93
  Top 0.406: U$15.5 43.36,5.03 43.35,5.02
  Bottom 0.152: v39.61,1.61 39.61,1.6 38.83,0.81 11.35,0.82 v8.65,3.52
  Bottom 0.254: 8.41,3.28 v8.65,3.52 6.78,3.52 5.81,4.5 5.81,11.2 v4.08,12.93
RPI_SDA  (via drill 0.5)
  Top 0.152: 1.44,20.32 1.44,19.81 0.65,19.03 0.65,15.22 0.4,14.96 0.4,13.18 v0.91,12.68 0.65,12.93
  Top 0.254: R9.1 1.53,20.39 Q4.2 1.44,20.32
  Bottom 0.152: U$15.3 44.59,3.63 44.59,0.99 44.09,0.48 10.56,0.48 10.56,0.81 8.63,2.75 6.32,2.75 4.94,4.12 4.94,4.9 0.63,9.22 0.63,12.4
  Bottom 0.254: 0.93,12.65 v0.91,12.68 0.63,12.4
RPI_TX  (via drill 0.5)
  Top 0.254: v16.91,10.9 16.83,10.9 16.81,10.87 15.33,10.87 13.53,9.07 13.53,8.26 U6.8
  Bottom 0.152: U$15.8 40.85,2.52 39.75,2.52 38.75,3.52 25.75,3.52 24.65,4.62 24.65,4.92 19.75,9.82 19.75,10.72 18.95,11.52 17.45,11.52 16.95,11.02 v16.91,10.9
SCK  (via drill 0.6)
  Top 0.152: U6.15 12.25,14.12 12.25,15.32 10.33,17.22 10.08,17.22 7.98,17.22 6.98,18.22 6.98,20.8 7.8,21.62 9.25,21.62 10.1,21.64 10.63,22.17 10.63,22.19 10.63,23.85 10.24,24.24 10.23,24.67 10.55,24.99 10.81,25.4 10.82,26.06 10.55,26.31 10.55,29.72 10.48,29.8
  Top 0.254: U2.D13 14.6,56.29 v11.85,53.57 | v13.15,42.9 13.12,39.98 13.12,32.44 10.48,29.8 U1.19
  Bottom 0.254: v11.85,53.57 11.85,51.72 13.17,50.37 v13.15,42.9
  Bottom 0.406: J1.3 9.01,28.43 U1.19
SCL  (via drill 0.3, 0.5)
  Top 0.152: U2.A5 48.85,10.42 41.95,17.32 41.45,17.32 39.15,15.02 35.65,15.02 33.35,12.72 33.35,12.62 32.35,11.62 32.35,9.92 31.35,8.92 v23.15,8.92
  Top 0.254: v11.73,49.13 9.95,47.35 8.14,47.35 7.2,46.41 6.11,45.29 6.11,36.73 6.62,36.22 v6.62,35.61 | Q3.3 2.91,16.21 3.7,16.99 6.24,16.99 | 6.24,16.99 6.75,16.49 6.75,15.96 R8.1 | 6.24,16.99 6.24,21.06 v7.08,21.9
  Bottom 0.152: v23.15,8.92 22.15,9.92 22.15,10.82 16.35,16.62 15.32,16.62 12.72,19.23
  Bottom 0.254: 8.59,51.19 U1.28 10.7,51.19 11.78,50.12 11.78,50.04 v11.73,49.13 | v6.62,35.61 7.61,34.75 9.69,34.75 10.99,33.48 10.99,25.66 10.41,25.07 10.41,24.87 10.13,24.59 10.13,24.21 10.89,23.45 10.89,22.35 | 10.89,22.35 12.72,20.53 12.72,19.23 | v7.08,21.9 10.43,21.9 10.89,22.35
SDA  (via drill 0.3, 0.5, 0.6)
  Top 0.152: U2.A4 46.25,10.32 44.54,8.88 44.24,8.88 40.95,8.9 40.05,9.82 40.05,10.72 39.51,11.26 39.51,12.42 38.24,13.69 37.48,13.69 36.24,12.45 36.18,12.45 v34.65,10.92 | v6.87,42.98 6.87,37.64 7.23,37.29 11.32,37.29 v11.47,37.44 | v27.09,18.49 24.78,16.18 v19.22,16.18
  Top 0.254: U1.27 8.54,48.65 5.55,45.67 5.55,35.31 v6.7,34.16 | v7.38,29.75 7.38,24.87 v7.79,24.54 | v5.88,22.84 5.73,22.84 4.97,22.07 4.97,20.51 R10.1 4.35,19.28 4.21,19.28 3.22,18.29 Q4.3
  Bottom 0.152: v6.87,42.98 7.35,43.46 7.35,46.53 8.95,48.13 8.95,48.62 U1.27 | v34.65,10.92 27.68,17.91 v27.09,18.49 | v19.22,16.18 19.08,16.42 19.08,29.28 18.46,29.9 18.48,29.93 18.4,30.01 18.4,34.05 17.77,34.85 15.03,34.85 12.41,37.42 v11.47,37.44
  Bottom 0.254: v6.7,34.16 6.7,30.43 v7.38,29.75 | v7.79,24.54 7.79,24.74 v5.88,22.84
VIN
  Top 0.813: IC1.IN 48.23,25.81 44.26,21.85 40.98,21.85 J2.PWR
  Top 1.016: J2.PWR 39.26,21.87 31.11,13.97 U2.VIN
VIN_5V  (via drill 0.6)
  Top 1.016: v40.02,33 37.15,33 35.32,31.17 35.32,28.87 C10.1 35.34,29.3 34.18,30.46 32.86,30.46 31.84,29.44 31.84,27.69 28.74,24.59 28.74,23.57 25.9,20.73 25.9,20.33 C9.+
  Bottom 1.016: IC1.OUT 45,36.83 41.9,33.73 41.9,30.46 F1.2 41.76,31.25 v40.02,33

### Text on the board
_tplace: 8 | 7 | 4 | 2 | 1 | 0 | 13 | 12 | ~9 | ~6 | ~5 | ~3 | GND | ~11 | ~10 | TX | RX | AREF | +5v | V_Reg | V_in | 5v | RESET | 3.3v | GND | GND | Vin | A0 | A1 | A2 | A3 | A4 | A5 | 3v3 | 5v | 1